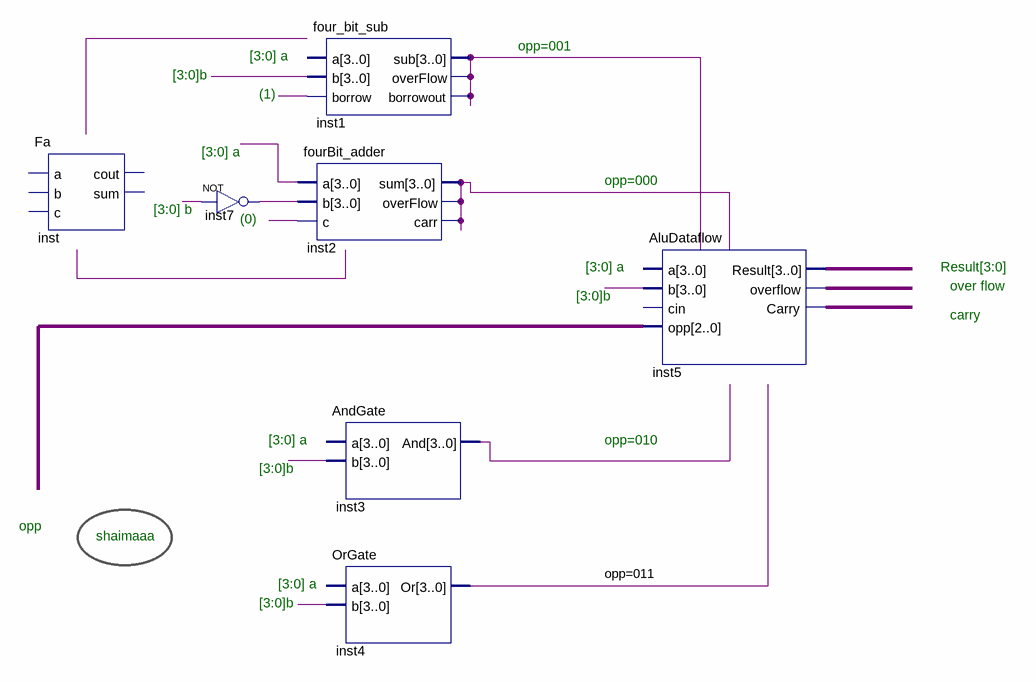
[diagram p0: schematic sheet]
// Quartus schematic Sympole for all project.bdf as structural Verilog: 7 symbols, 0 pins
module \Sympole_for_all_project  (
);

  wire inst1_sub, inst2_sum, inst3_and, inst5_carry, inst5_overflow, inst7_out, \opp=011 , undriven_2,
       undriven_3, undriven_4, undriven_5, undriven_6, undriven_7, undriven_8, undriven_9;
  wire [2:0] undriven;
  wire [3:0] inst5_result;

  Fa inst ();  // open: a, b, c, cout, sum
  not inst7 (inst7_out, undriven_4);
  fourBit_adder inst2 (
    .a({4{undriven_5}}), .b({4{inst7_out}}), .c(undriven_3), .sum(inst2_sum), .overFlow(inst2_sum),
    .carr(inst2_sum));
  four_bit_sub inst1 (
    .b({4{undriven_6}}), .borrow(undriven_2), .sub(inst1_sub), .overFlow(inst1_sub), .borrowout(inst1_sub));  // open: a
  AndGate inst3 (.b({4{undriven_9}}), .And(inst3_and));  // open: a
  OrGate inst4 (.b({4{undriven_7}}), .Or(\opp=011 ));  // open: a
  AluDataflow inst5 (
    .b({4{undriven_8}}), .opp(undriven), .Result(inst5_result), .overflow(inst5_overflow), .Carry(inst5_carry));  // open: a, cin

  // Notes on the sheet:
  //   opp=001
  //   [3:0] a
  //   [3:0]b
  //   (1)
  //   [3:0] a
  //   opp=000
  //   [3:0] b
  //   (0)
  //   [3:0] a
  //   Result[3:0]
  //   over flow
  //   [3:0]b
  //   carry
  //   [3:0] a
  //   opp=010
  //   [3:0]b
  //   opp
  //   shaimaaa
  //   [3:0] a
  //   [3:0]b
endmodule
